# EAGLE schematic gem_cape (EAGLE 7.7.0)
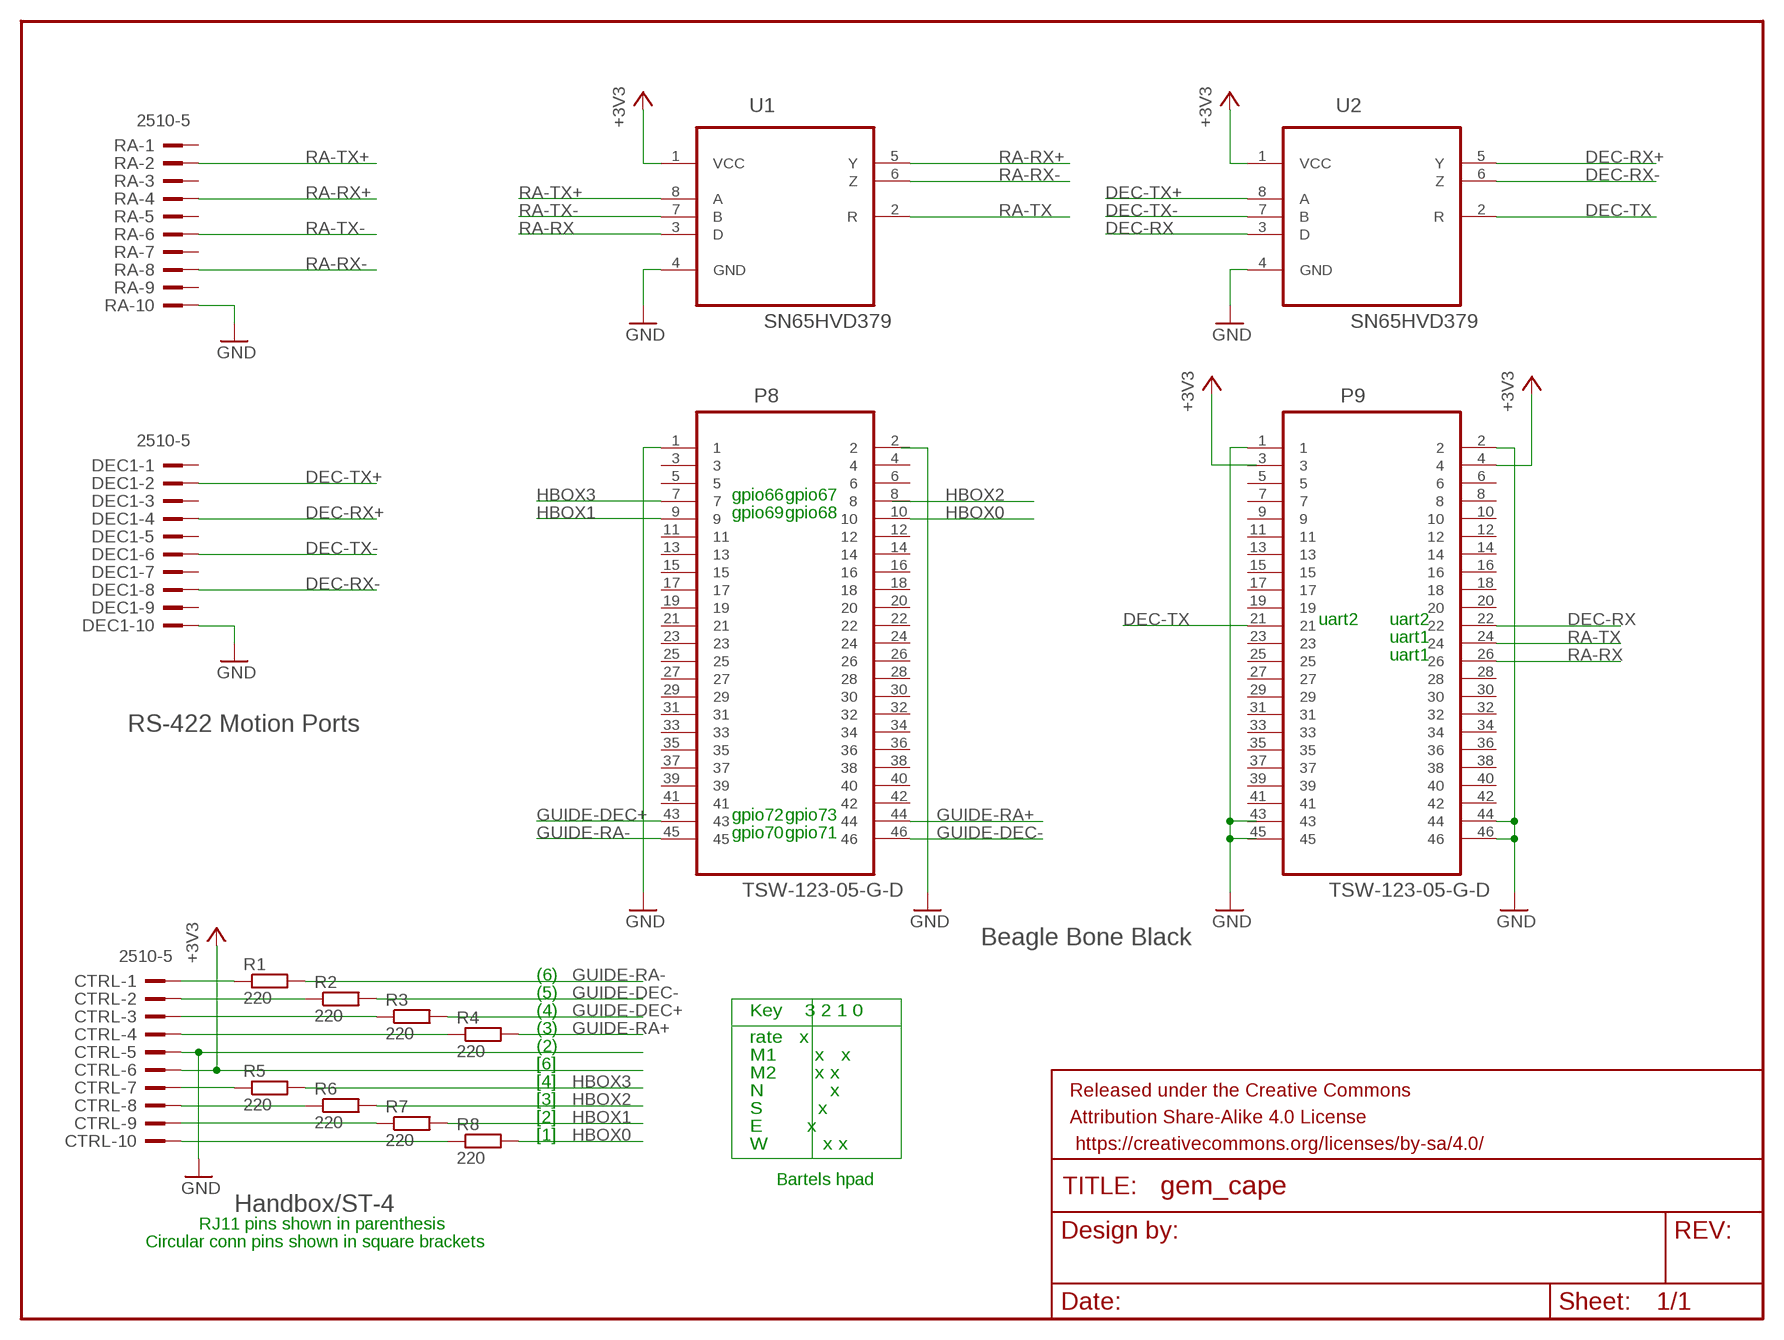
[diagram p0: schematic, sheet 1]

## Parts
CTRL  2510-5  [PAK100/2500-5-10]
DEC1  2510-5  [PAK100/2500-5-10]
FRAME1  FRAME-LETTER  [CREATIVE_COMMONS]
P8  TSW-123-05-G-D  [SAMTEC_TSW-123-05-G-D]
P9  TSW-123-05-G-D  [SAMTEC_TSW-123-05-G-D]
R1  220  R-EU_R0805  [R0805]
R2  220  R-EU_R0805  [R0805]
R3  220  R-EU_R0805  [R0805]
R4  220  R-EU_R0805  [R0805]
R5  220  R-EU_R0805  [R0805]
R6  220  R-EU_R0805  [R0805]
R7  220  R-EU_R0805  [R0805]
R8  220  R-EU_R0805  [R0805]
RA  2510-5  [PAK100/2500-5-10]
U1  SN65HVD379  SN65HVD32DR  [SOIC127P600X175-8N]
U2  SN65HVD379  SN65HVD32DR  [SOIC127P600X175-8N]

## Nets
+3V3: CTRL.6 P9.4 U1.1(VCC) U2.1(VCC)
DEC-RX: P9.22 U2.3(D)
DEC-RX+: DEC1.4 U2.5(Y)
DEC-RX-: DEC1.8 U2.6(Z)
DEC-TX: P9.21 U2.2(R)
DEC-TX+: DEC1.2 U2.8(A)
DEC-TX-: DEC1.6 U2.7(B)
GND: CTRL.5 DEC1.10 P8.1 P9.1 P9.2 P9.44 P9.46 RA.10 U1.4(GND) U2.4(GND)
GUIDE-DEC+: P8.43 R3.2
GUIDE-DEC-: P8.46 R2.2
GUIDE-RA+: P8.44 R4.2
GUIDE-RA-: P8.45 R1.2
HBOX0: P8.10 R8.2
HBOX1: P8.9 R7.2
HBOX2: P8.8 R6.2
HBOX3: P8.7 R5.2
N$9: CTRL.1 R1.1
N$10: CTRL.2 R2.1
N$11: CTRL.3 R3.1
N$12: CTRL.4 R4.1
N$13: CTRL.7 R5.1
N$14: CTRL.8 R6.1
N$15: CTRL.9 R7.1
N$16: CTRL.10 R8.1
RA-RX: P9.26 U1.3(D)
RA-RX+: RA.4 U1.5(Y)
RA-RX-: RA.8 U1.6(Z)
RA-TX: P9.24 U1.2(R)
RA-TX+: RA.2 U1.8(A)
RA-TX-: RA.6 U1.7(B)
Unconnected: DEC1.1 DEC1.3 DEC1.5 DEC1.7 DEC1.9 P8.2 P8.3 P8.4 P8.5 P8.6 P8.11 P8.12 P8.13 P8.14 P8.15 P8.16 P8.17 P8.18 P8.19 P8.20 P8.21 P8.22 P8.23 P8.24 P8.25 P8.26 P8.27 P8.28 P8.29 P8.30 P8.31 P8.32 P8.33 P8.34 P8.35 P8.36 P8.37 P8.38 P8.39 P8.40 P8.41 P8.42 P9.3 P9.5 P9.6 P9.7 P9.8 P9.9 P9.10 P9.11 P9.12 P9.13 P9.14 P9.15 P9.16 P9.17 P9.18 P9.19 P9.20 P9.23 P9.25 P9.27 P9.28 P9.29 P9.30 P9.31 P9.32 P9.33 P9.34 P9.35 P9.36 P9.37 P9.38 P9.39 P9.40 P9.41 P9.42 P9.43 P9.45 RA.1 RA.3 RA.5 RA.7 RA.9

## Notes on the sheet
- gpio66 | gpio67
- gpio69 | gpio68
- uart2 | uart2
- uart1
- uart1
- RS-422 Motion Ports
- gpio72 | gpio73
- gpio70 | gpio71
- Beagle Bone Black
- (6)
- (5)
- (4) | Key    3 2 1 0
- (3)
- rate   x
- (2)
- M1       x   x
- [6]
- M2       x x
- [4]
- N            x
- [3]
- S          x
- [2]
- E        x
- [1]
- W          x x
- Bartels hpad
- Handbox/ST-4
- RJ11 pins shown in parenthesis
- Circular conn pins shown in square brackets

## Library data of the parts
CTRL DEC1 RA = con-3m:2510-: 3M (TM) Pak 100 4-Wall Header Source: 3M; OC_FARNELL: 1788669; OC_NEWARK: unknown
FRAME1 = SparkFun-Aesthetics:FRAME-LETTER: Schematic Frame Standard 8.5x11 US Letter frame
P8 P9 = SAMTEC-TSW-xxx-D_By_element14_Batch_1:TSW-123-05-G-D: POST HEADER , THROUGH-HOLE; MPN: TSW-123-05-G-D; OC_FARNELL: 2024660; OC_NEWARK: 12P2647; PACKAGE: Post header-46Pin; SUPPLIER: Samtec
R1-R8 = resistor:R-EU_: RESISTOR, European symbol
U1 U2 = Texas Instruments_By_element14_Batch_1:SN65HVD32DR: FULL-DUPLEX RS-485 DRIVERS AND RECEIVERS; MPN: SN65HVD379; PACKAGE: SOIC-8; SUPPLIER: TI